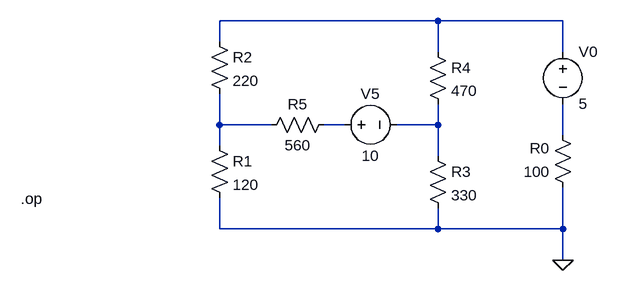
[diagram p0: schematic mesh_analysis_ltspice.asc]
mesh_analysis_ltspice.asc, the LTspice schematic file:
Version 4
SHEET 1 880 680
WIRE 416 288 80 288
WIRE 608 288 416 288
WIRE 80 320 80 288
WIRE 416 336 416 288
WIRE 608 336 608 288
WIRE 80 448 80 400
WIRE 160 448 80 448
WIRE 272 448 240 448
WIRE 416 448 416 416
WIRE 416 448 352 448
WIRE 608 464 608 416
WIRE 80 480 80 448
WIRE 416 496 416 448
WIRE 80 608 80 560
WIRE 416 608 416 576
WIRE 416 608 80 608
WIRE 608 608 608 544
WIRE 608 608 416 608
WIRE 608 656 608 608
FLAG 608 656 0
DATAFLAG 80 448 ""
DATAFLAG 80 608 ""
DATAFLAG 608 432 ""
DATAFLAG 416 448 ""
DATAFLAG 416 288 ""
DATAFLAG 256 448 ""
DATAFLAG 576 288 ""
SYMBOL res 64 464 R0
SYMATTR InstName R1
SYMATTR Value 120
SYMBOL res 64 304 R0
SYMATTR InstName R2
SYMATTR Value 220
SYMBOL res 400 480 R0
SYMATTR InstName R3
SYMATTR Value 330
SYMBOL res 400 320 R0
SYMATTR InstName R4
SYMATTR Value 470
SYMBOL res 256 432 R90
WINDOW 0 0 56 VBottom 2
WINDOW 3 32 56 VTop 2
SYMATTR InstName R5
SYMATTR Value 560
SYMBOL res 624 560 R180
WINDOW 0 36 76 Left 2
WINDOW 3 36 40 Left 2
SYMATTR InstName R0
SYMATTR Value 100
SYMBOL voltage 608 320 R0
WINDOW 123 0 0 Left 0
WINDOW 39 0 0 Left 0
SYMATTR InstName V0
SYMATTR Value 5
SYMBOL voltage 256 448 R270
WINDOW 0 32 56 VTop 2
WINDOW 3 -32 56 VBottom 2
WINDOW 123 0 0 Left 0
WINDOW 39 0 0 Left 0
SYMATTR InstName V5
SYMATTR Value 10
TEXT -226 562 Left 2 !.op

The netlist it stands for:
* mesh_analysis_ltspice.asc
R1 N002 0 120
R2 N001 N002 220
R3 N004 0 330
R4 N001 N004 470
R5 N003 N002 560
R0 0 N005 100
V0 N001 N005 5
V5 N003 N004 10
.op
.backanno
.end